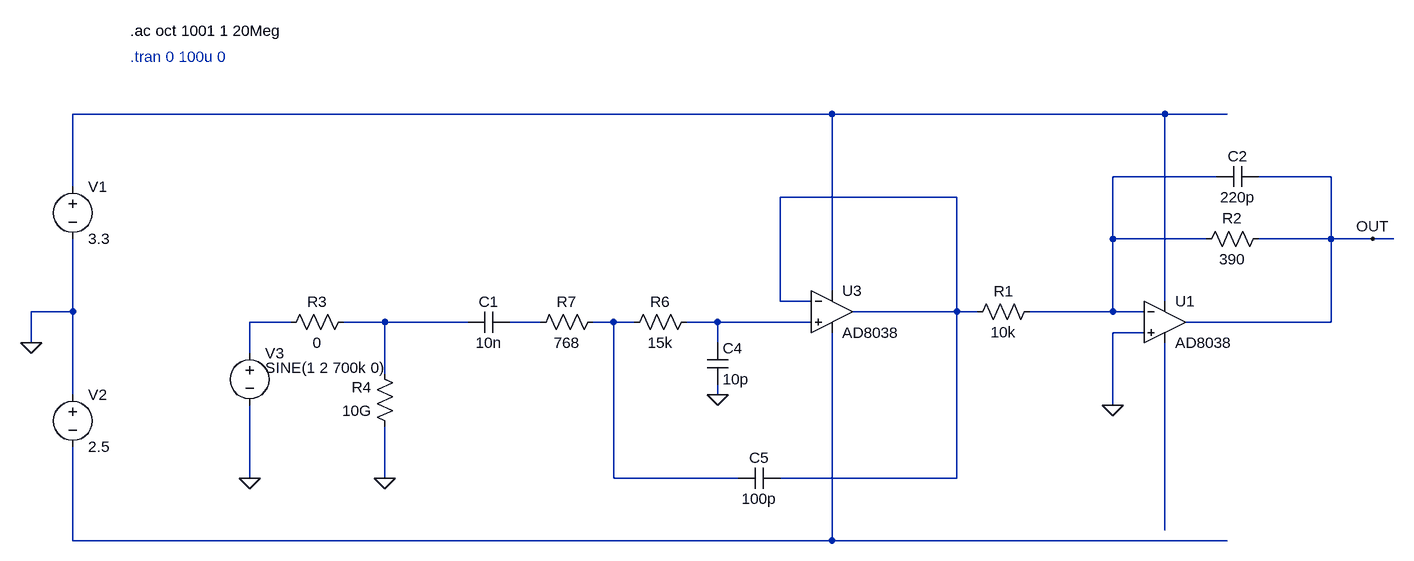
[diagram p0: schematic OldVSensor_swap_ad8038.asc]
OldVSensor_swap_ad8038.asc, the LTspice schematic file:
Version 4
SHEET 1 2244 1272
WIRE 1168 -16 0 -16
WIRE 1680 -16 1168 -16
WIRE 1776 -16 1680 -16
WIRE 1760 80 1600 80
WIRE 1936 80 1824 80
WIRE 0 96 0 -16
WIRE 1360 112 1088 112
WIRE 1600 176 1600 80
WIRE 1744 176 1600 176
WIRE 1936 176 1936 80
WIRE 1936 176 1824 176
WIRE 2000 176 1936 176
WIRE 2032 176 2000 176
WIRE 1168 256 1168 -16
WIRE 1088 272 1088 112
WIRE 1136 272 1088 272
WIRE 1680 272 1680 -16
WIRE 0 288 0 176
WIRE 0 288 -64 288
WIRE 1360 288 1360 112
WIRE 1360 288 1200 288
WIRE 1392 288 1360 288
WIRE 1600 288 1600 176
WIRE 1600 288 1472 288
WIRE 1648 288 1600 288
WIRE 336 304 272 304
WIRE 480 304 416 304
WIRE 608 304 480 304
WIRE 720 304 672 304
WIRE 832 304 800 304
WIRE 864 304 832 304
WIRE 992 304 944 304
WIRE 1136 304 992 304
WIRE 1936 304 1936 176
WIRE 1936 304 1712 304
WIRE 1648 320 1600 320
WIRE -64 336 -64 288
WIRE 992 336 992 304
WIRE 272 352 272 304
WIRE 480 384 480 304
WIRE 0 416 0 288
WIRE 992 416 992 400
WIRE 1600 432 1600 320
WIRE 272 544 272 432
WIRE 480 544 480 464
WIRE 832 544 832 304
WIRE 1024 544 832 544
WIRE 1360 544 1360 288
WIRE 1360 544 1088 544
WIRE 1680 624 1680 336
WIRE 0 640 0 496
WIRE 1168 640 1168 320
WIRE 1168 640 0 640
WIRE 1776 640 1168 640
FLAG -64 336 0
FLAG 1600 432 0
FLAG 272 544 0
FLAG 480 544 0
FLAG 2000 176 OUT
FLAG 992 416 0
SYMBOL voltage 0 80 R0
SYMATTR InstName V1
SYMATTR Value 3.3
SYMBOL voltage 0 400 R0
SYMATTR InstName V2
SYMATTR Value 2.5
SYMBOL voltage 272 336 R0
WINDOW 3 24 38 Left 2
SYMATTR InstName V3
SYMATTR Value SINE(1 2 700k 0)
SYMATTR Value2 AC 1 0
SYMBOL cap 672 288 R90
WINDOW 0 0 32 VBottom 2
WINDOW 3 32 32 VTop 2
SYMATTR InstName C1
SYMATTR Value 10n
SYMBOL cap 1824 64 R90
WINDOW 0 0 32 VBottom 2
WINDOW 3 32 32 VTop 2
SYMATTR InstName C2
SYMATTR Value 220p
SYMBOL res 1488 272 R90
WINDOW 0 0 56 VBottom 2
WINDOW 3 32 56 VTop 2
SYMATTR InstName R1
SYMATTR Value 10k
SYMBOL res 1840 160 R90
WINDOW 0 0 56 VBottom 2
WINDOW 3 32 56 VTop 2
SYMATTR InstName R2
SYMATTR Value 390
SYMBOL res 432 288 R90
WINDOW 0 0 56 VBottom 2
WINDOW 3 32 56 VTop 2
SYMATTR InstName R3
SYMATTR Value 0
SYMBOL res 496 480 R180
WINDOW 0 36 76 Left 2
WINDOW 3 36 40 Left 2
SYMATTR InstName R4
SYMATTR Value 10G
SYMBOL res 960 288 R90
WINDOW 0 0 56 VBottom 2
WINDOW 3 32 56 VTop 2
SYMATTR InstName R6
SYMATTR Value 15k
SYMBOL res 816 288 R90
WINDOW 0 0 56 VBottom 2
WINDOW 3 32 56 VTop 2
SYMATTR InstName R7
SYMATTR Value 768
SYMBOL cap 976 336 R0
SYMATTR InstName C4
SYMATTR Value 10p
SYMBOL cap 1088 528 R90
WINDOW 0 0 32 VBottom 2
WINDOW 3 32 32 VTop 2
SYMATTR InstName C5
SYMATTR Value 100p
SYMBOL Opamps/AD8038 1168 224 R0
SYMATTR InstName U3
SYMBOL Opamps/AD8038 1680 240 R0
SYMATTR InstName U1
TEXT 88 -104 Left 2 ;.tran 0 100u 0
TEXT 88 -144 Left 2 !.ac oct 1001 1 20Meg

The netlist it stands for:
* OldVSensor_swap_ad8038.asc
V1 N001 0 3.3
V2 0 N010 2.5
V3 N004 0 SINE(1 2 700k 0) AC 1 0
C1 N006 N005 10n
C2 OUT N002 220p
R1 N002 N003 10k
R2 OUT N002 390
R3 N005 N004 0
R4 0 N005 10G
R6 N008 N007 15k
R7 N007 N006 768
C4 N008 0 10p
C5 N003 N007 100p
XU3 N008 N003 N001 N010 N003 AD8038  ; pins In+ In- V+ V- OUT
XU1 0 N002 N001 N009 OUT AD8038  ; pins In+ In- V+ V- OUT
* .tran 0 100u 0
.ac oct 1001 1 20Meg
.backanno
.end